# Altium project fixture.PrjPCB
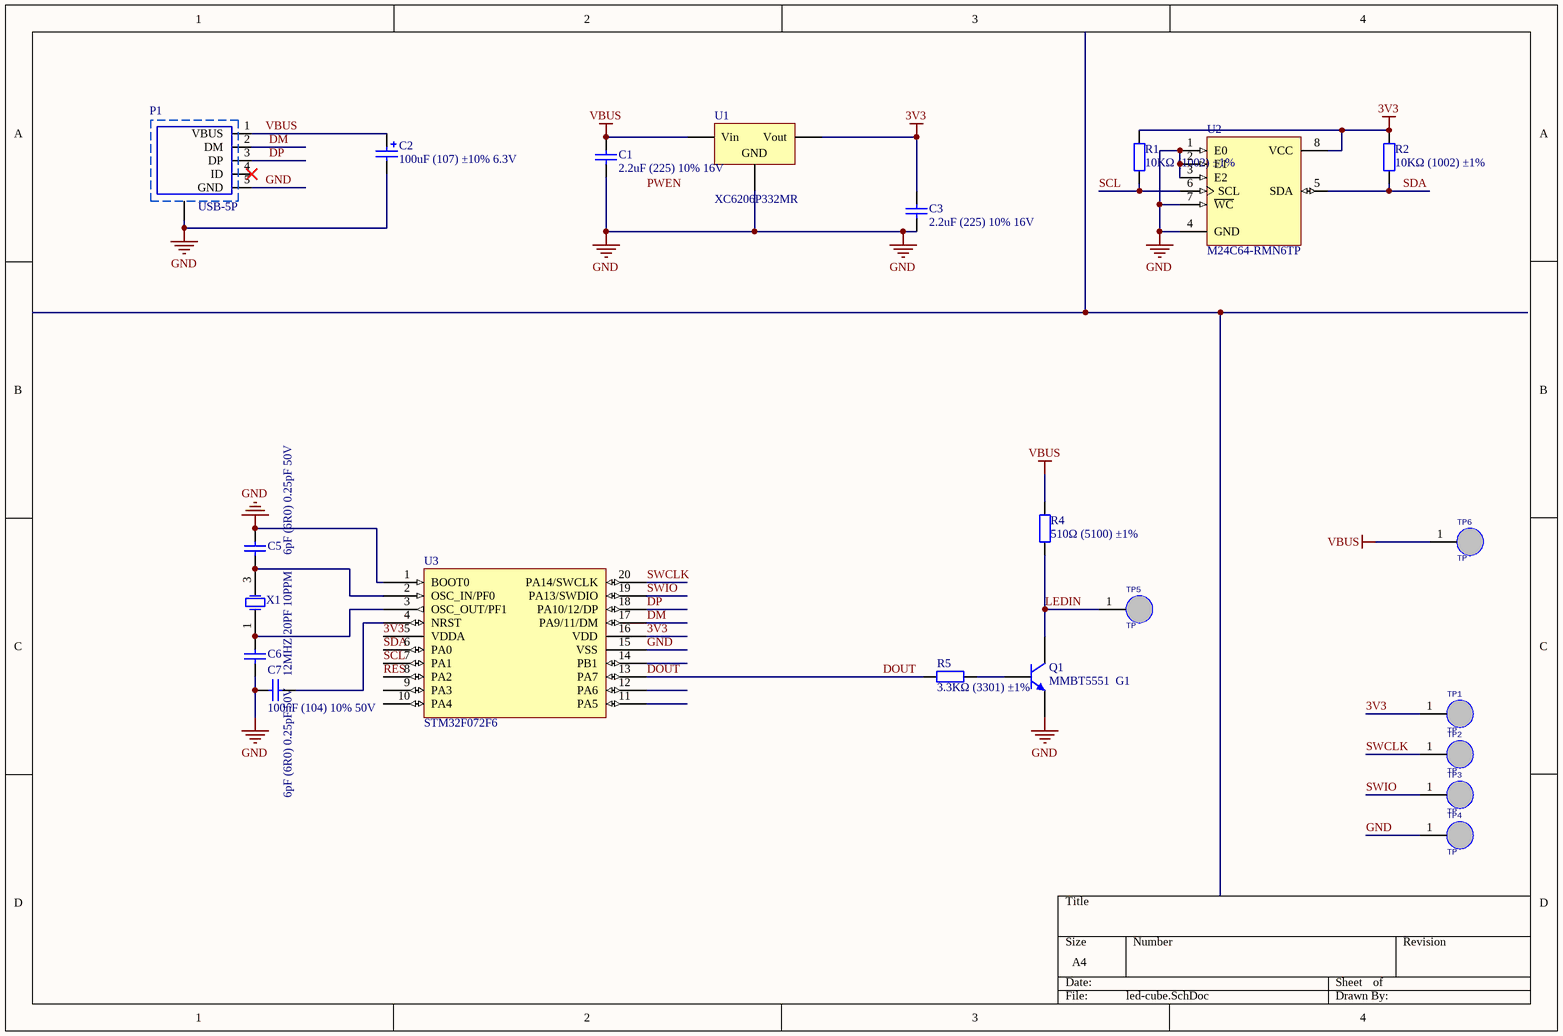
[diagram p0: led-cube.SchDoc]
1 sheet, 22 parts. Net scope: global (net labels, ports and power ports of the same name join across sheets).
Board file: fixture.PcbDoc

## Sheet led-cube.SchDoc
size A4

### Parts
C1  2.2uF (225) 10% 16V  [LC-0603_C]
C2  100uF (107) ±10% 6.3V  [LC-CASE-B_3528]
C3  2.2uF (225) 10% 16V  [LC-0603_C]
C5  6pF (6R0) 0.25pF 50V  [LC-0603_C]
C6  6pF (6R0) 0.25pF 50V  [LC-0603_C]
C7  100nF (104) 10% 50V  [LC-0603_C]
P1  USB-5P  [USBMICRO-5P]
Q1  MMBT5551  G1  [LC-SOT-23(SOT-23-3)]
R1  10KΩ (1002) ±1%  [LC-0603_R]
R2  10KΩ (1002) ±1%  [LC-0603_R]
R4  510Ω (5100) ±1%  [LC-0603_R]
R5  3.3KΩ (3301) ±1%  [LC-0603_R]
TP1  TP  [TestPoint]
TP2  TP  [TestPoint]
TP3  TP  [TestPoint]
TP4  TP  [TestPoint]
TP5  TP  [TestPoint]
TP6  TP  [TestPoint]
U1  XC6206P332MR  [LC-SOT-23-3L]
U2  M24C64-RMN6TP  [LC-SOIC-8_150mil]
U3  STM32F072F6  [TSSOP20]
X1  12MHZ 20PF 10PPM  [LC-SMD-3225_4P]

### Nets
3V3: C3.2 R1.1 R2.1 TP1.1 U1.2(Vout) U2.8(VCC) U3.5(VDDA) U3.16(VDD)
GND: C1.1 C2.2 C3.1 C5.1 C6.2 C7.2 P1.5(GND) P1.Shell Q1.2(E) TP4.1 U1.1(GND) U2.1(E0) U2.2(E1) U2.3(E2) U2.4(GND) U2.7(~{WC}) U3.1(BOOT0) U3.15(VSS)
VBUS: C1.2 C2.1 P1.1(VBUS) R4.2 TP6.1 U1.3(Vin)
DM: P1.2(DM) U3.17(PA9/11/DM)
DOUT: R5.1 U3.13(PA7)
DP: P1.3(DP) U3.18(PA10/12/DP)
LEDIN: Q1.3(C) R4.1 TP5.1
RES: U3.8(PA2)
SCL: R1.2 U2.6(SCL) U3.7(PA1)
SDA: R2.2 U2.5(SDA) U3.6(PA0)
SWCLK: TP2.1 U3.20(PA14/SWCLK)
SWIO: TP3.1 U3.19(PA13/SWDIO)
NetC5_2: C5.2 U3.2(OSC_IN/PF0) X1.3(OSC2)
NetC6_1: C6.1 U3.3(OSC_OUT/PF1) X1.1(OSC1)
NetC7_1: C7.1 U3.4(NRST)
NetQ1_1: Q1.1(B) R5.2

Not connected (* = marked no-connect by the designer): P1 4(ID)*; U3 9(PA3) 10(PA4) 11(PA5) 12(PA6) 14(PB1)

### Notes on the sheet
- Labels drawn without touching a wire or pin: PWEN

### Library data of the parts
C1 C3 = 0603 2.2uF (225) 10% 16V: 贴片电容; ComponentLink1Description: 供应商链接; ComponentLink1URL: http://www.szlcsc.com/product/details_24366.html; Package: 0603; Supplier: LC; SuppliersPartNumber: C23630
C2 = 3528 100uF (107) 10% 6.3V: 钽电容; ComponentLink1Description: 供应商链接; ComponentLink1URL: http://www.szlcsc.com/product/details_16815.html; Package: 3528; Supplier: LC; SuppliersPartNumber: C16133
C5 C6 = 0603 6pF (6R0) 0.25pF 50V: 贴片电容; ComponentLink1Description: 供应商链接; ComponentLink1URL: http://www.szlcsc.com/product/details_38453.html; Package: 0603; Supplier: LC; SuppliersPartNumber: C37474
C7 = 0603 100nF (104) 10% 50V: 贴片电容; ComponentLink1Description: 供应商链接; ComponentLink1URL: http://www.szlcsc.com/product/details_15331.html; Package: 0603; Supplier: LC; SuppliersPartNumber: C14663
Q1 = SOT-23 MMBT5551  G1: 三极管; ComponentLink1Description: 供应商链接; ComponentLink1URL: http://www.szlcsc.com/product/details_2502.html; Package: SOT-23; Supplier: LC; SuppliersPartNumber: C2145
R1 R2 = 0603 10KΩ (1002) 1%: 贴片电阻; ComponentLink1Description: 供应商链接; ComponentLink1URL: http://www.szlcsc.com/product/details_26547.html; Package: 0603; Supplier: LC; SuppliersPartNumber: C25804
R4 = 0603 510Ω (5100) 1%: 贴片电阻; ComponentLink1Description: 供应商链接; ComponentLink1URL: http://www.szlcsc.com/product/details_23920.html; Package: 0603; Supplier: LC; SuppliersPartNumber: C23193
R5 = 0603 3.3KΩ (3301) 1%: 贴片电阻; ComponentLink1Description: 供应商链接; ComponentLink1URL: http://www.szlcsc.com/product/details_23705.html; Package: 0603; Supplier: LC; SuppliersPartNumber: C22978
TP1-TP6 = TP: 测试点; Part Field 1: 20; Part Field 2: 20
U1 = SOT-23 XC6206P332MR: 低压差线性稳压(LDO); ComponentLink1Description: 供应商链接; ComponentLink1URL: http://www.szlcsc.com/product/details_5896.html; Package: SOT-23; Supplier: LC; SuppliersPartNumber: C5446
U2 = M24C64-RMN6TP: EEPROM; ComponentLink1Description: 供应商链接; ComponentLink1URL: http://www.szlcsc.com/product/details_81133.html; Package: SOIC-8_150mil; Supplier: LC; SuppliersPartNumber: C79988
X1 = SMD-3225_4P  12MHZ 20PF 10PPM: 贴片晶振; ComponentLink1Description: 供应商链接; ComponentLink1URL: http://www.szlcsc.com/product/details_9522.html; Package: SMD-3225_4P; Supplier: LC; SuppliersPartNumber: C9002